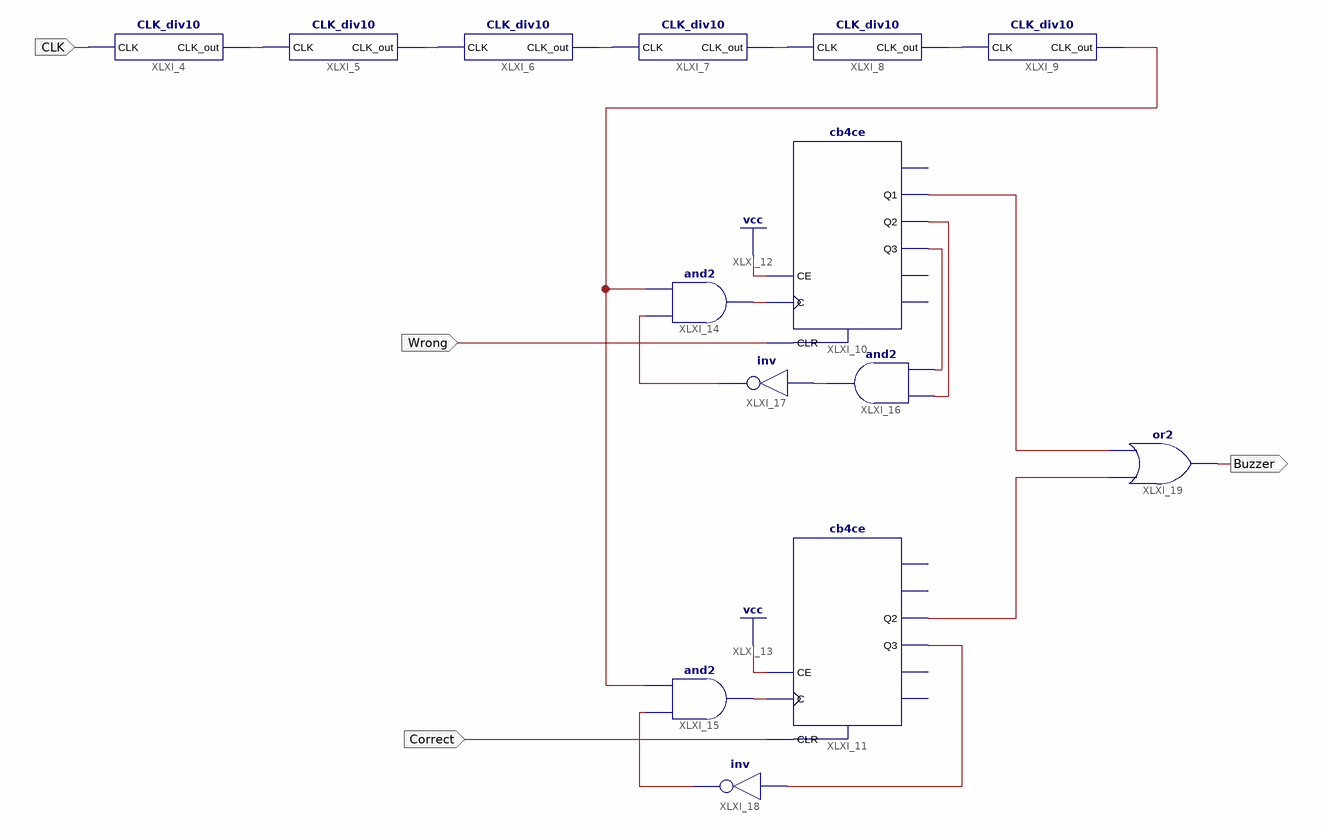
[diagram p0: schematic sheet 1]
// Xilinx ISE schematic Buzzer_Check.sch (spartan6) as structural Verilog: 14 symbols, 4 ports
module Buzzer_Check (
  input  CLK,
  input  Wrong,
  input  Correct,
  output Buzzer
);

  wire XLXN_1, XLXN_2, XLXN_3, XLXN_4, XLXN_5, XLXN_9, XLXN_10, XLXN_11, XLXN_15, XLXN_17, XLXN_18, XLXN_19,
       XLXN_20, XLXN_21, XLXN_22, XLXN_23;

  CLK_div10 XLXI_4 (.CLK(CLK), .CLK_out(XLXN_1));
  CLK_div10 XLXI_5 (.CLK(XLXN_1), .CLK_out(XLXN_2));
  CLK_div10 XLXI_6 (.CLK(XLXN_2), .CLK_out(XLXN_3));
  CLK_div10 XLXI_7 (.CLK(XLXN_3), .CLK_out(XLXN_4));
  CLK_div10 XLXI_8 (.CLK(XLXN_4), .CLK_out(XLXN_5));
  CLK_div10 XLXI_9 (.CLK(XLXN_5), .CLK_out(XLXN_15));
  cb4ce XLXI_10 (.C(XLXN_9), .CE(1'b1), .CLR(Wrong), .Q1(XLXN_21), .Q2(XLXN_20), .Q3(XLXN_19));  // open: CEO, Q0, TC
  cb4ce XLXI_11 (.C(XLXN_10), .CE(1'b1), .CLR(Correct), .Q2(XLXN_22), .Q3(XLXN_23));  // open: CEO, Q0, Q1, TC
  and XLXI_14 (XLXN_9, XLXN_18, XLXN_15);
  and XLXI_15 (XLXN_10, XLXN_17, XLXN_15);
  and XLXI_16 (XLXN_11, XLXN_19, XLXN_20);
  not XLXI_17 (XLXN_18, XLXN_11);
  not XLXI_18 (XLXN_17, XLXN_23);
  or XLXI_19 (Buzzer, XLXN_22, XLXN_21);
endmodule
